# Altium schematic sheet Microcontroller.SchDoc: Microcontroller
size A2; Author: Andy Nicholson; Engineer: Andy Nicholson; Organization: WSU; Address1: Werrington; DocumentNumber: 1; Revision: 2; SheetNumber: 1; SheetTotal: 3
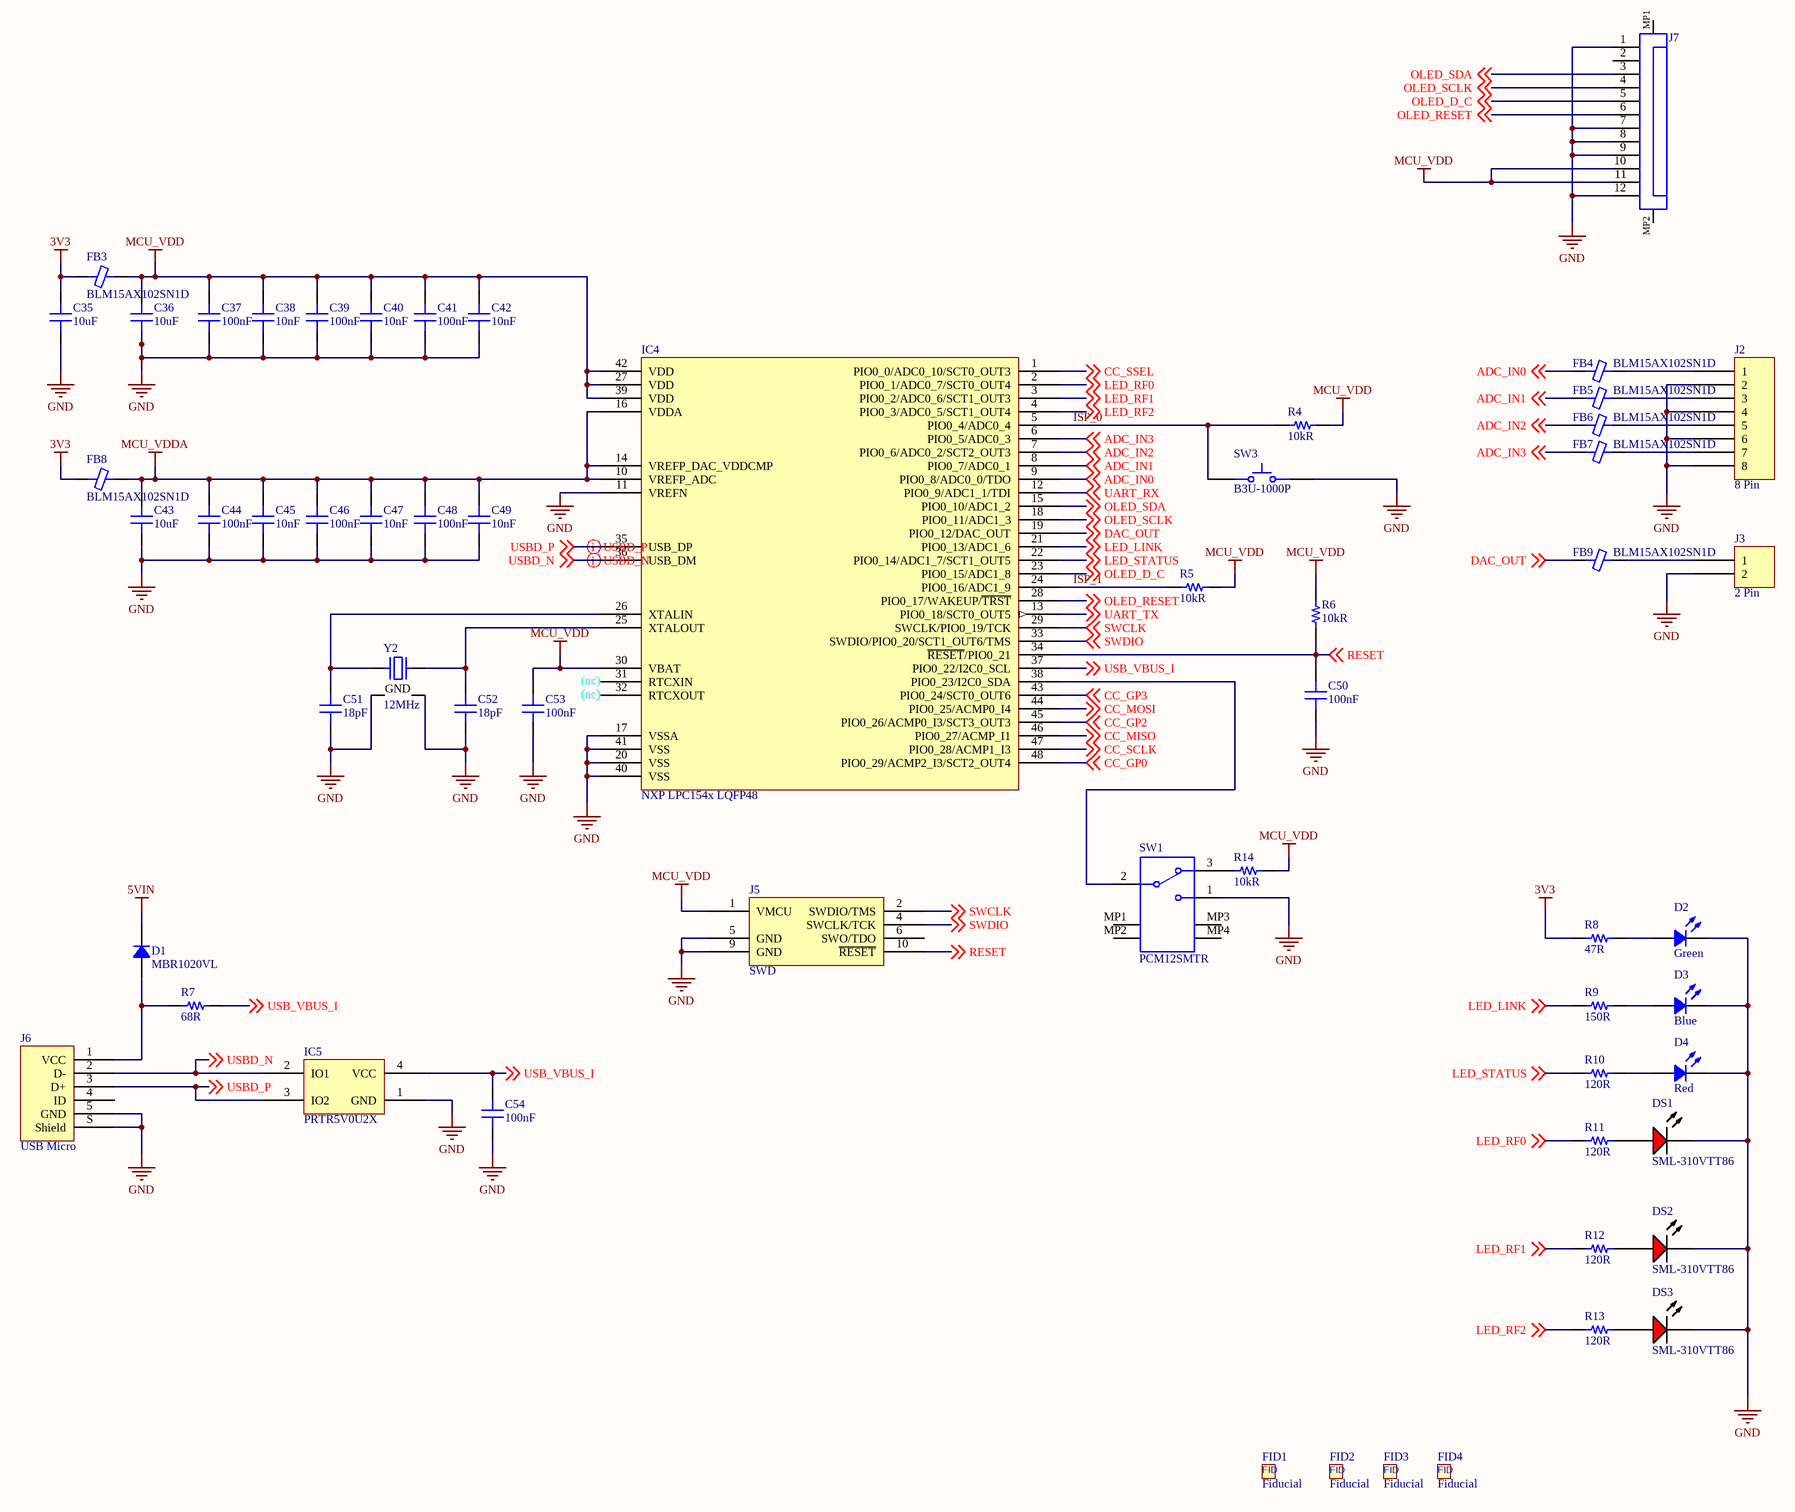
[diagram p0: Microcontroller.SchDoc]

## Parts
C35  10uF  [CAP 0805/2012]
C36  10uF  [CAP 0805/2012]
C37  100nF  [CAP 0402/1005]
C38  10nF  [CAP 0402/1005]
C39  100nF  [CAP 0402/1005]
C40  10nF  [CAP 0402/1005]
C41  100nF  [CAP 0402/1005]
C42  10nF  [CAP 0402/1005]
C43  10uF  [CAP 0805/2012]
C44  100nF  [CAP 0402/1005]
C45  10nF  [CAP 0402/1005]
C46  100nF  [CAP 0402/1005]
C47  10nF  [CAP 0402/1005]
C48  100nF  [CAP 0402/1005]
C49  10nF  [CAP 0402/1005]
C50  100nF  [CAP 0402/1005]
C51  18pF  [CAP 0402/1005]
C52  18pF  [CAP 0402/1005]
C53  100nF  [CAP 0402/1005]
C54  100nF  [CAP 0402/1005]
D1  MBR1020VL  [SOD123F]
D2  Green  [LED 0603/1608 GREEN]
D3  Blue  [LED 0603/1608 BLUE]
D4  Red  [LED 0603/1608 RED]
DS1  SML-310VTT86  [ROHM-SML-31X_V]
DS2  SML-310VTT86  [ROHM-SML-31X_V]
DS3  SML-310VTT86  [ROHM-SML-31X_V]
FB3  BLM15AX102SN1D  [FER 0402/1005]
FB4  BLM15AX102SN1D  [FER 0402/1005]
FB5  BLM15AX102SN1D  [FER 0402/1005]
FB6  BLM15AX102SN1D  [FER 0402/1005]
FB7  BLM15AX102SN1D  [FER 0402/1005]
FB8  BLM15AX102SN1D  [FER 0402/1005]
FB9  BLM15AX102SN1D  [FER 0402/1005]
FID1  Fiducial  [Fiducial]  (no BOM)
FID2  Fiducial  [Fiducial]  (no BOM)
FID3  Fiducial  [Fiducial]  (no BOM)
FID4  Fiducial  [Fiducial]  (no BOM)
IC4  NXP LPC154x LQFP48  [NXP LQFP-48 7x7mm]
IC5  PRTR5V0U2X  [SOT143B]
J2  8 Pin  [FCI 06-381-8PIN]
J3  2 Pin  [FCI 06-381-2PIN]
J5  SWD  [10 Pin SWD]  (no BOM)
J6  USB Micro  [FCI USB 10118193-0001LF]
J7  687112183722  [687112183722]  (value not drawn)
R4  10kR  [RES 0402/1005]
R5  10kR  [RES 0402/1005]
R6  10kR  [RES 0402/1005]
R7  68R  [RES 0402/1005]
R8  47R  [RES 0402/1005]
R9  150R  [RES 0402/1005]
R10  120R  [RES 0402/1005]
R11  120R  [RES 0402/1005]
R12  120R  [RES 0402/1005]
R13  120R  [RES 0402/1005]
R14  10kR  [RES 0402/1005]
SW1  PCM12SMTR  [CKCP-PCM12SMTR_V]
SW3  B3U-1000P  [OMRON-B3U-1000_V]
Y2  12MHz  [ABRACON ABM8G]

## Nets
3V3: C35.2 FB3.2 FB8.2 R8.1
5VIN: D1.2
GND: C35.1 C36.1 C37.1 C38.1 C39.1 C40.1 C41.1 C42.1 C43.1 C44.1 C45.1 C46.1 C47.1 C48.1 C49.1 C50.1 C51.1 C52.1 C53.1 C54.1 D2.2 D3.2 D4.2 DS1.2(K) DS2.2(K) DS3.2(K) IC4.11(VREFN) IC4.17(VSSA) IC4.20(VSS) IC4.40(VSS) IC4.41(VSS) IC5.1(GND) J2.2 J2.4 J2.6 J2.8 J3.2 J5.5(GND) J5.9(GND) J6.5(GND) J6.S(Shield) J7.1 J7.7 J7.8 J7.9 J7.12 SW1.1 SW3.2 Y2.2(GND) Y2.4(GND)
MCU_VDD: C36.2 C37.2 C38.2 C39.2 C40.2 C41.2 C42.2 C53.2 FB3.1 IC4.27(VDD) IC4.30(VBAT) IC4.39(VDD) IC4.42(VDD) J5.1(VMCU) J7.10 J7.11 R4.1 R5.1 R6.1 R14.1
MCU_VDDA: C43.2 C44.2 C45.2 C46.2 C47.2 C48.2 C49.2 FB8.1 IC4.10(VREFP_ADC) IC4.14(VREFP_DAC_VDDCMP) IC4.16(VDDA)
ADC_IN0: FB4.2 IC4.9(PIO0_8/ADC0_0/TDO) ; off-sheet ADC_IN0
ADC_IN1: FB5.2 IC4.8(PIO0_7/ADC0_1) ; off-sheet ADC_IN1
ADC_IN2: FB6.2 IC4.7(PIO0_6/ADC0_2/SCT2_OUT3) ; off-sheet ADC_IN2
ADC_IN3: FB7.2 IC4.6(PIO0_5/ADC0_3) ; off-sheet ADC_IN3
CC_GP0: IC4.48(PIO0_29/ACMP2_I3/SCT2_OUT4) ; off-sheet CC_GP0
CC_GP2: IC4.45(PIO0_26/ACMP0_I3/SCT3_OUT3) ; off-sheet CC_GP2
CC_GP3: IC4.43(PIO0_24/SCT0_OUT6) ; off-sheet CC_GP3
CC_MISO: IC4.46(PIO0_27/ACMP_I1) ; off-sheet CC_MISO
CC_MOSI: IC4.44(PIO0_25/ACMP0_I4) ; off-sheet CC_MOSI
CC_SCLK: IC4.47(PIO0_28/ACMP1_I3) ; off-sheet CC_SCLK
CC_SSEL: IC4.1(PIO0_0/ADC0_10/SCT0_OUT3) ; off-sheet CC_SSEL
DAC_OUT: FB9.2 IC4.19(PIO0_12/DAC_OUT) ; off-sheet DAC_OUT
ISP_0: IC4.5(PIO0_4/ADC0_4) R4.2 SW3.1
ISP_1: IC4.24(PIO0_16/ADC1_9) R5.2
LED_LINK: IC4.21(PIO0_13/ADC1_6) R9.1 ; off-sheet LED_LINK
LED_RF0: IC4.2(PIO0_1/ADC0_7/SCT0_OUT4) R11.1 ; off-sheet LED_RF0
LED_RF1: IC4.3(PIO0_2/ADC0_6/SCT1_OUT3) R12.1 ; off-sheet LED_RF1
LED_RF2: IC4.4(PIO0_3/ADC0_5/SCT1_OUT4) R13.1 ; off-sheet LED_RF2
LED_STATUS: IC4.22(PIO0_14/ADC1_7/SCT1_OUT5) R10.1 ; off-sheet LED_STATUS
OLED_D_C: IC4.23(PIO0_15/ADC1_8) J7.5 ; off-sheet OLED_D_C
OLED_RESET: IC4.28(PIO0_17/WAKEUP/~{TRST}) J7.6 ; off-sheet OLED_RESET
OLED_SCLK: IC4.18(PIO0_11/ADC1_3) J7.4 ; off-sheet OLED_SCLK
OLED_SDA: IC4.15(PIO0_10/ADC1_2) J7.3 ; off-sheet OLED_SDA
RESET: C50.2 IC4.34(~{RESET}/PIO0_21) J5.10(~{RESET}) R6.2 ; off-sheet RESET
SWCLK: IC4.29(SWCLK/PIO0_19/TCK) J5.2(SWDIO/TMS) ; off-sheet SWCLK
SWDIO: IC4.33(SWDIO/PIO0_20/SCT1_OUT6/TMS) J5.4(SWCLK/TCK) ; off-sheet SWDIO
UART_RX: IC4.12(PIO0_9/ADC1_1/TDI) ; off-sheet UART_RX
UART_TX: IC4.13(PIO0_18/SCT0_OUT5) ; off-sheet UART_TX
USB_VBUS_I: C54.2 IC4.37(PIO0_22/I2C0_SCL) IC5.4(VCC) R7.1 ; off-sheet USB_VBUS_I
USBD_N: IC4.36(USB_DM) IC5.2(IO1) J6.2(D-) ; off-sheet USBD_N
USBD_P: IC4.35(USB_DP) IC5.3(IO2) J6.3(D+) ; off-sheet USBD_P
NetC51_2: C51.2 IC4.26(XTALIN) Y2.1
NetC52_2: C52.2 IC4.25(XTALOUT) Y2.3
NetD1_1: D1.1 J6.1(VCC) R7.2
NetD2_1: D2.1 R8.2
NetD3_1: D3.1 R9.2
NetD4_1: D4.1 R10.2
NetDS1_1: DS1.1(A) R11.2
NetDS2_1: DS2.1(A) R12.2
NetDS3_1: DS3.1(A) R13.2
NetFB4_1: FB4.1 J2.1
NetFB5_1: FB5.1 J2.3
NetFB6_1: FB6.1 J2.5
NetFB7_1: FB7.1 J2.7
NetFB9_1: FB9.1 J3.1
NetIC4_38: IC4.38(PIO0_23/I2C0_SDA) SW1.2
NetR14_2: R14.2 SW1.3

Not connected (* = marked no-connect by the designer): IC4 31(RTCXIN) 32(RTCXOUT); J5 6(SWO/TDO); J6 4(ID); J7 2 MP1 MP2; SW1 MP1 MP2 MP3 MP4

## Layout directives
differential pair: USBD_N, USBD_P

## Notes on the sheet
- (nc)
- Title
- Size:
- Date:
- File:
- A2
- Number:
- Time:
- Revision:
- Sheet
- of
- (in symbol Fiducial) FID

## Library data of the parts
C35 C36 C43 = Capacitor: Cap Ceramic 10uF 10V X5R 10% SMD 0805 85C Embossed T/R; Manufacturer 1: Samsung; Manufacturer Part Number 1: CL21A106KPFNNNG; Supplier 1: Digi-Key; Supplier Part Number 1: 1276-6456-1-ND; RoHS: Yes; Category: Ceramic Capacitors; Stock 1: 443468; Pricing 1: 1=0.13000, 10=0.09100, 100=0.04300, 500=0.03016, 1000=0.02497 (USD); Mount: Surface Mount; Case/Package: 0805; Case Code (Metric): 2012; Case Code (Imperial): 0805; Min Operating Temperature: -55°C; Max Operating Temperature: 85°C; Capacitance: 10uF; Tolerance: 10%; Dielectric: X5R; Voltage: 10V; Voltage Rating: 10V; Packaging: Tape and Reel; Package Quantity: 3000; Termination: Wraparound; Length: 2mm; Height: 1.25mm; Depth: 1.25mm; Width: 0.049inch; Thickness: 0.053inch; Radiation Hardening: No; Lead Free: Lead Free; ComponentLink1URL: https://datasheet.ciiva.com/16428/cl21a106kpfnnng-16428896.pdf?src-supplier=Future+Electronics; ComponentLink1Description: https://datasheet.ciiva.com/16428/cl21a106kpfnnng-16428896.pdf?src-supplier=Future+Electronics; ComponentLink2URL: https://datasheet.ciiva.com/26936/getdatasheetpartid-640497-26936900.pdf?src-supplier=Verical; ComponentLink2Description: https://datasheet.ciiva.com/26936/getdatasheetpartid-640497-26936900.pdf?src-supplier=Verical
C37 C39 C41 C44 C46 C48 C50 C53 C54 = Capacitor: Cap Ceramic 0.1uF 10V X5R 20% Pad SMD 0402 85C T/R; Manufacturer 1: Samsung; Manufacturer Part Number 1: CL05A104MP5NNNC; Supplier 1: Digi-Key; Supplier Part Number 1: 1276-1443-1-ND; RoHS: Yes; Category: Ceramic Capacitors; Stock 1: 4686080; Pricing 1: 1=0.10000, 10=0.01900, 100=0.00830, 500=0.00592, 1000=0.00465, 2500=0.00422, 5000=0.00389 (USD); Mount: Surface Mount; Case/Package: 0402; Case Code (Metric): 1005; Case Code (Imperial): 0402; Min Operating Temperature: -55°C; Max Operating Temperature: 85°C; Packaging: Tape and Reel; Capacitance: 100nF; Tolerance: 20%; Voltage Rating: 10V; Dielectric: X5R; Voltage Rating (DC): 10V; Length: 1mm; Height: 0.5mm; Width: 0.02inch; Thickness: 0.022inch; Depth: 0.5mm; Radiation Hardening: No; Lead Free: Lead Free; ComponentLink1URL: https://datasheet.ciiva.com/25709/cl05a104mp5nnnc-25709105.pdf?src-supplier=Digi-Key; ComponentLink1Description: https://datasheet.ciiva.com/25709/cl05a104mp5nnnc-25709105.pdf?src-supplier=Digi-Key
C38 C40 C42 C45 C47 C49 = Capacitor: TAIYO YUDEN - TMK105B7103KV-F - CERAMIC CAPACITOR 0.01UF, 25V, X7R, 10%, 0402, FULL REEL; Supplier 1: Digi-Key; Supplier Part Number 1: 587-1223-1-ND; Manufacturer 1: Taiyo Yuden; Manufacturer Part Number 1: TMK105B7103KV-F; RoHS: Yes; Category: Ceramic Capacitors; Stock 1: 1448575; Pricing 1: 1=0.10000, 10=0.01700, 100=0.00780, 500=0.00554, 1000=0.00436, 2500=0.00396, 5000=0.00364 (USD); Mount: Surface Mount; Case/Package: 0402; Case Code (Metric): 1005; Case Code (Imperial): 0402; Contact Plating: Tin; Min Operating Temperature: -55°C; Max Operating Temperature: 125°C; Capacitance: 10nF; Tolerance: 10%; Package Quantity: 1; Voltage Rating: 25V; Packaging: Tape and Reel; Voltage Rating (DC): 25V; Dielectric: X7R; Termination: SMD/SMT; Composition: Ceramic; Voltage: 25V; Length: 1mm; Height: 0.5mm; Width: 0.02inch; Thickness: 0.022inch; Depth: 0.5mm; REACH SVHC: Unknown; Halogen Free: Halogen Free; ComponentLink1URL: https://datasheet.ciiva.com/129/tmk105b7103kv-f-ss-129699.pdf?src-supplier=Digi-Key; ComponentLink1Description: https://datasheet.ciiva.com/129/tmk105b7103kv-f-ss-129699.pdf?src-supplier=Digi-Key; ComponentLink2URL: https://datasheet.ciiva.com/30192/438tmk105b7103kv-f-30192315.pdf?src-supplier=Onlinecomponents.com; ComponentLink2Description: https://datasheet.ciiva.com/30192/438tmk105b7103kv-f-30192315.pdf?src-supplier=Onlinecomponents.com; ComponentLink3URL: https://datasheet.ciiva.com/15922/204tmk105b7103kv-f-15922348.pdf?src-supplier=Onlinecomponents.com; ComponentLink3Description: https://datasheet.ciiva.com/15922/204tmk105b7103kv-f-15922348.pdf?src-supplier=Onlinecomponents.com; ComponentLink4URL: https://datasheet.ciiva.com/30156/190tmk105b7103kv-f-30156174.pdf?src-supplier=Onlinecomponents.com; ComponentLink4Description: https://datasheet.ciiva.com/30156/190tmk105b7103kv-f-30156174.pdf?src-supplier=Onlinecomponents.com; ComponentLink5URL: https://datasheet.ciiva.com/7975/746258-7975835.pdf?src-supplier=Element14; ComponentLink5Description: https://datasheet.ciiva.com/7975/746258-7975835.pdf?src-supplier=Element14; ComponentLink6URL: https://datasheet.ciiva.com/28645/746258-28645254.pdf?src-supplier=Element14; ComponentLink6Description: https://datasheet.ciiva.com/28645/746258-28645254.pdf?src-supplier=Element14
C51 C52 = Capacitor: CAP CER 18PF 50V C0G/NPO 0402; Manufacturer 1: Yageo; Manufacturer Part Number 1: CC0402JRNPO9BN180; Tolerance: 5%; Dielectric: C0G; Temperature Coefficient: 30ppm/°C; Supplier 1: Digi-Key; Supplier Part Number 1: 311-1415-1-ND; RoHS: Yes; Category: Ceramic Capacitors; Stock 1: 739848; Pricing 1: 1=0.10000, 10=0.02300, 100=0.01030, 500=0.00736, 1000=0.00578, 2500=0.00525, 5000=0.00483 (USD); Mount: Surface Mount; Case/Package: 0402; Number of Pins: 2; Weight: 2.3E-05oz; Case Code (Metric): 1005; Case Code (Imperial): 0402; Min Operating Temperature: -55°C; Max Operating Temperature: 125°C; Capacitance: 18pF; Voltage Rating: 50V; Packaging: Tape and Reel; Package Quantity: 1; Voltage Rating (DC): 50V; Termination: SMD/SMT; Composition: Ceramic; Voltage: 50V; Length: 1mm; Height: 0.5mm; Width: 0.02inch; Thickness: 0.022inch; Depth: 0.5mm; Radiation Hardening: No; REACH SVHC: No SVHC; Lead Free: Lead Free; ComponentLink1URL: https://datasheet.ciiva.com/11788/0900766b80d84fbf-11788369.pdf?src-supplier=RSComponents; ComponentLink1Description: https://datasheet.ciiva.com/11788/0900766b80d84fbf-11788369.pdf?src-supplier=RSComponents; ComponentLink2URL: https://datasheet.ciiva.com/176/mlccorderingcode-176357.pdf?src-supplier=Digi-Key; ComponentLink2Description: https://datasheet.ciiva.com/176/mlccorderingcode-176357.pdf?src-supplier=Digi-Key; ComponentLink3URL: https://datasheet.ciiva.com/176/mlccorderingcode-176358.pdf?src-supplier=Digi-Key; ComponentLink3Description: https://datasheet.ciiva.com/176/mlccorderingcode-176358.pdf?src-supplier=Digi-Key; ComponentLink4URL: https://datasheet.ciiva.com/176/mlccorderingcode-176359.pdf?src-supplier=Digi-Key; ComponentLink4Description: https://datasheet.ciiva.com/176/mlccorderingcode-176359.pdf?src-supplier=Digi-Key; ComponentLink5URL: https://datasheet.ciiva.com/28450/1443161-28450232.pdf?src-supplier=Element14; ComponentLink5Description: https://datasheet.ciiva.com/28450/1443161-28450232.pdf?src-supplier=Element14; ComponentLink6URL: https://datasheet.ciiva.com/13208/upy-gp-np0-16v-to-50v-8-13208430.pdf?src-supplier=Mouser; ComponentLink6Description: https://datasheet.ciiva.com/13208/upy-gp-np0-16v-to-50v-8-13208430.pdf?src-supplier=Mouser; ComponentLink7URL: https://datasheet.ciiva.com/11587/upy-gp-np0-16v-to-50v-8-11587087.pdf?src-supplier=Avnet; ComponentLink7Description: https://datasheet.ciiva.com/11587/upy-gp-np0-16v-to-50v-8-11587087.pdf?src-supplier=Avnet
D1 = Diode: DIODE SCHOTTKY 20V 1A SOD123F; Manufacturer 1: ON Semiconductor / Fairchild; Reverse Recovery Time: 12.4ns; Element Configuration: Single; Max Forward Surge Current (Ifsm): 45A; Supplier 1: Digi-Key; Supplier Part Number 1: MBR1020VLCT-ND; Manufacturer Part Number 1: MBR1020VL; RoHS: Yes; Category: Rectifier Diodes; Stock 1: 14914; Pricing 1: 1=0.41000, 10=0.30300, 100=0.17170, 500=0.11370, 1000=0.08717 (USD); Mount: Surface Mount; Weight: 0.0276g; Packaging: Tape and Reel; Average Rectified Current: 1A; Max Repetitive Reverse Voltage (Vrrm): 20V; Max Reverse Voltage (DC): 20V; ComponentLink1URL: http://www.farnell.com/datasheets/2552643.pdf?src-supplier=Farnell; ComponentLink1Description: http://www.farnell.com/datasheets/2552643.pdf?src-supplier=Farnell; ComponentLink2URL: https://www.fairchildsemi.com/datasheets/MB/MBR1020VL.pdf?src-supplier=Digi-Key; ComponentLink2Description: https://www.fairchildsemi.com/datasheets/MB/MBR1020VL.pdf?src-supplier=Digi-Key; ComponentLink3URL: http://www.farnell.com/datasheets/2552643.pdf?src-supplier=Newark; ComponentLink3Description: http://www.farnell.com/datasheets/2552643.pdf?src-supplier=Newark
D2 = LED: 0603 green led allngap 571nm-574nm water clear 18-71mcd 130d; Manufacturer 1: Vishay Lite-On; Manufacturer Part Number 1: LTST-C190KGKT; Lens Color: Colorless; Lens Style: Diffused,Colorless,Rectangular,Clear; Forward Voltage: 2V; Luminous Intensity: 35mcd; Viewing Angle: 130°; Dominant Wavelength: 571nm; Test Current: 20mA; Wavelength: 574nm; Forward Current: 30mA; Power Rating: 75mW; Number of Elements: 1; Reverse Voltage: 5V; Supplier 1: Digi-Key; Supplier Part Number 1: 160-1435-1-ND; RoHS: Yes; Category: LEDs; Stock 1: 642633; Pricing 1: 1=0.26000, 10=0.18800, 100=0.08880, 500=0.05922, 1000=0.04639 (USD); Mount: Surface Mount; Case/Package: 0603; Number of Pins: 2; Color: Green; Case Code (Metric): 1608; Case Code (Imperial): 0603; Min Operating Temperature: -55°C; Max Operating Temperature: 85°C; Packaging: Tape and Reel; Package Quantity: 1; Lens Transparency: Clear; Illumination Color: Green; Power Dissipation: 75mW; Number of LEDs: 1; Length: 1.6mm; Height: 0.8mm; Width: 0.8mm; Depth: 0.8mm; Radiation Hardening: No; Lead Free: Lead Free; ComponentLink1URL: https://datasheet.ciiva.com/15117/getdatasheetpartid-141494-15117731.pdf?src-supplier=Verical; ComponentLink1Description: https://datasheet.ciiva.com/15117/getdatasheetpartid-141494-15117731.pdf?src-supplier=Verical; ComponentLink2URL: https://datasheet.ciiva.com/12403/100-ltst-c190kgkt-63268-12403899.pdf?src-supplier=Mouser; ComponentLink2Description: https://datasheet.ciiva.com/12403/100-ltst-c190kgkt-63268-12403899.pdf?src-supplier=Mouser; ComponentLink3URL: https://datasheet.ciiva.com/11774/0900766b80dc02a8-11774060.pdf?src-supplier=RSComponents; ComponentLink3Description: https://datasheet.ciiva.com/11774/0900766b80dc02a8-11774060.pdf?src-supplier=RSComponents; ComponentLink4URL: https://datasheet.ciiva.com/2109/s-110-ltst-c190kgkt-2109988.pdf?src-supplier=Digi-Key; ComponentLink4Description: https://datasheet.ciiva.com/2109/s-110-ltst-c190kgkt-2109988.pdf?src-supplier=Digi-Key; ComponentLink5URL: https://datasheet.ciiva.com/2109/s-110-ltst-c190kgkt-2109989.pdf?src-supplier=Digi-Key; ComponentLink5Description: https://datasheet.ciiva.com/2109/s-110-ltst-c190kgkt-2109989.pdf?src-supplier=Digi-Key; ComponentLink6URL: https://datasheet.ciiva.com/2109/s-110-ltst-c190kgkt-2109990.pdf?src-supplier=Digi-Key; ComponentLink6Description: https://datasheet.ciiva.com/2109/s-110-ltst-c190kgkt-2109990.pdf?src-supplier=Digi-Key
D3 = LED: LED Uni-Color Blue 468nm 2-Pin Chip 0603(1608Metric) T/R; Manufacturer 1: Everlight; Manufacturer Part Number 1: 19-213SUBC/S400-A5/S208-2/TR8; Supplier 1: Digi-Key; Supplier Part Number 1: 1080-1581-1-ND; Stock 1: 47392; Pricing 1: 1=0.34000, 10=0.24900, 100=0.11810, 500=0.07876, 1000=0.06169, 2500=0.06038, 5000=0.05250 (USD); ComponentLink1URL: https://media.digikey.com/pdf/Data%20Sheets/Everlight%20PDFs/19-213SUBC-S400-A5-S208-2-TR8.pdf?src-supplier=Digi-Key; ComponentLink1Description: https://media.digikey.com/pdf/Data%20Sheets/Everlight%20PDFs/19-213SUBC-S400-A5-S208-2-TR8.pdf?src-supplier=Digi-Key
D4 = LED: LED RED DIFFUSED 1608 SMD; Manufacturer 1: Rohm; Manufacturer Part Number 1: SML-D12U1WT86; Lens Color: White; Luminous Intensity: 63mcd; Test Current: 20mA; Dominant Wavelength: 620nm; Forward Voltage: 2.2V; Supplier 1: Digi-Key; Supplier Part Number 1: SML-D12U1WT86CT-ND; RoHS: Yes; Category: LEDs; Stock 1: 96413; Pricing 1: 1=0.21000, 10=0.15500, 100=0.07330, 500=0.04884, 1000=0.03826 (USD); Mount: Surface Mount; Case/Package: 0603; Color: Red; Case Code (Metric): 1608; Case Code (Imperial): 0603; Packaging: Tape and Reel; Lens Transparency: Diffused; Length: 1.6mm; Height: 0.65mm; Width: 0.8mm; Lead Free: Lead Free; ComponentLink1URL: https://www.rohm.com/datasheet/SML-D12U1W?src-supplier=Digi-Key; ComponentLink1Description: https://www.rohm.com/datasheet/SML-D12U1W?src-supplier=Digi-Key
DS1-DS3 = CMP-2000-07115-1: Standard Type Mini-Molded Chip LED, Red, 2 V, 20 mA, -30 to 85 degC, 2-Pin SMD, RoHS, Tape and Reel; Manufacturer: Rohm; Intensity: 4mcd; Lens Type: Clear; Forward (Drive) Current: 20mA; Viewing Angle: 140°; Forward Voltage: 2V; Manufacturer URL: http://www.rohm.com/web/global/; Datasheet URL: http://media.digikey.com/pdf/Data%20Sheets/Rohm%20PDFs/SML-310%20Series.pdf; Package Description: 2-Pin Surface Mount Device, Body 1.6 x 0.8 mm; Color: Red; Dimension: 1.6x0.8x0.8mm; Datasheet Version: Rev. 1.1, 07/2004; Package Reference: SML-31X; Mounting Technology: SurfaceMount
FB3-FB9 = Ferrite Chip: Ferrite Beads Multi-Layer 1KOhm 25% 100MHz 350mA 490mOhm DCR 0402 T/R; Manufacturer 1: Murata; Material: Ferrite,Steel; Impedance: 1kR; Number of Lines: 1; DC Resistance (DCR): 490mR; Supplier 1: Digi-Key; Supplier Part Number 1: 490-5442-1-ND; Manufacturer Part Number 1: BLM15AX102SN1D; RoHS: Yes; Category: Ferrite Beads and Chips; Stock 1: 214606; Pricing 1: 1=0.11000, 10=0.09000, 25=0.08120, 50=0.05960, 100=0.05140, 250=0.04060, 500=0.03428, 1000=0.02886, 5000=0.02571 (USD); Case/Package: 0402; Number of Pins: 2; Case Code (Metric): 1005; Case Code (Imperial): 0402; Min Operating Temperature: -55°C; Max Operating Temperature: 125°C; Package Quantity: 1; Tolerance: 25%; Packaging: Tape and Reel; Current Rating: 350mA; Max Current Rating: 350mA; Termination: SMD/SMT; Max DC Current: 350mA; Test Frequency: 100MHz; Number of Circuits: 1; Length: 1mm; Height: 0.5mm; Width: 0.5mm; Depth: 0.5mm; REACH SVHC: No SVHC; Lead Free: Lead Free; ComponentLink1URL: https://datasheet.ciiva.com/41425/001171674-da-01-en-chip-drossel0402-1000r-350ma-1-0x0-5mm-41425706.pdf?src-supplier=Conrad; ComponentLink1Description: https://datasheet.ciiva.com/41425/001171674-da-01-en-chip-drossel0402-1000r-350ma-1-0x0-5mm-41425706.pdf?src-supplier=Conrad; ComponentLink2URL: https://datasheet.ciiva.com/41449/001172166-da-01-en-drossel-0402-1000r-31-0x0-5mm-10000st-41449452.pdf?src-supplier=Conrad; ComponentLink2Description: https://datasheet.ciiva.com/41449/001172166-da-01-en-drossel-0402-1000r-31-0x0-5mm-10000st-41449452.pdf?src-supplier=Conrad; ComponentLink3URL: https://datasheet.ciiva.com/1012/l0110e-1012389.pdf?src-supplier=Digi-Key; ComponentLink3Description: https://datasheet.ciiva.com/1012/l0110e-1012389.pdf?src-supplier=Digi-Key; ComponentLink4URL: https://datasheet.ciiva.com/1012/l0110e-1012390.pdf?src-supplier=Digi-Key; ComponentLink4Description: https://datasheet.ciiva.com/1012/l0110e-1012390.pdf?src-supplier=Digi-Key; ComponentLink5URL: https://datasheet.ciiva.com/1012/l0110e-1012391.pdf?src-supplier=Digi-Key; ComponentLink5Description: https://datasheet.ciiva.com/1012/l0110e-1012391.pdf?src-supplier=Digi-Key; ComponentLink6URL: https://datasheet.ciiva.com/16420/l0110s0100blm15ax-sn-16420798.pdf?src-supplier=Future+Electronics; ComponentLink6Description: https://datasheet.ciiva.com/16420/l0110s0100blm15ax-sn-16420798.pdf?src-supplier=Future+Electronics
IC4 = NXP LPC154x LQFP48: IC MCU 32BIT 256KB FLASH 48LQFP; Manufacturer 1: NXP Semiconductors; Manufacturer Part Number 1: LPC1549JBD48QL; Core Architecture: ARM; Interface: I2C,SPI,USB,CAN,UART,USART; Min Supply Voltage: 2.4V; Max Supply Voltage: 3.6V; Operating Supply Voltage: 3.3V; RAM Size: 36KB; Number of I/Os: 30; Frequency: 72MHz; Data Bus Width: 32b; Max Power Dissipation: 1.5W; Number of Timers/Counters: 4; Watchdog Timer: Yes; Oscillator Type: Internal; Number of ADC Channels: 16; Peripherals: Brown-out Detect/Reset,POR,PWM,WDT,DMA; Supplier 1: Digi-Key; Supplier Part Number 1: 568-11349-ND; RoHS: Yes; Category: Microcontrollers; Stock 1: 822; Pricing 1: 1=7.29000, 10=6.58500, 25=6.27920, 100=5.45210, 500=4.74766, 1000=4.13505 (USD); Case/Package: LQFP; Number of Pins: 48; Weight: 6.287584oz; Min Operating Temperature: -40°C; Max Operating Temperature: 105°C; Package Quantity: 250; Packaging: Tray; Memory Size: 256KB; Memory Type: FLASH; Number of Programmable I/O: 30; Max Frequency: 72MHz; Radiation Hardening: No; REACH SVHC: No SVHC; Lead Free: Lead Free; ComponentLink1URL: https://datasheet.ciiva.com/29718/lpc15xx-29718838.pdf?src-supplier=Digi-Key; ComponentLink1Description: https://datasheet.ciiva.com/29718/lpc15xx-29718838.pdf?src-supplier=Digi-Key; ComponentLink2URL: https://datasheet.ciiva.com/46427/1802143-46427720.pdf?src-supplier=Element14; ComponentLink2Description: https://datasheet.ciiva.com/46427/1802143-46427720.pdf?src-supplier=Element14
IC5 = NXP PRTR5V0U2X: TVS DIODE 5.5V SOT143B; Manufacturer 1: Nexperia USA; Manufacturer Part Number 1: PRTR5V0U2X,215; Supplier 1: Digi-Key; Supplier Part Number 1: 1727-3884-1-ND; RoHS: No; Stock 1: 224080; Pricing 1: 1=0.52000, 10=0.44700, 100=0.33400, 500=0.26240, 1000=0.20276 (USD); ComponentLink1URL: https://assets.nexperia.com/documents/data-sheet/PRTR5V0U2X.pdf?src-supplier=Digi-Key; ComponentLink1Description: https://assets.nexperia.com/documents/data-sheet/PRTR5V0U2X.pdf?src-supplier=Digi-Key
J2 = 8 Pin: TERM BLOCK HDR 8POS 90DEG 3.81MM; Manufacturer 1: Amphenol Anytek; Manufacturer Part Number 1: OQ0832510000G; Supplier 1: Digi-Key; Supplier Part Number 1: 609-3825-ND; RoHS: No; Stock 1: 4787; Pricing 1: 1=1.06000, 10=0.66200, 25=0.56640, 50=0.50920, 100=0.49860, 250=0.42432, 500=0.40310, 1000=0.36067, 5000=0.28217 (USD); ComponentLink1URL: http://www.anytek.com.tw/UserUpFiles/20120526/jMKyryrC5T7A.pdf?src-supplier=Digi-Key; ComponentLink1Description: http://www.anytek.com.tw/UserUpFiles/20120526/jMKyryrC5T7A.pdf?src-supplier=Digi-Key
J3 = 2 Pin: TERM BLOCK HDR 2POS 90DEG 3.81MM; Manufacturer 1: Amphenol; Manufacturer Part Number 1: OQ0232510000G; Supplier 1: Digi-Key; Supplier Part Number 1: 609-3819-ND; RoHS: No; Stock 1: 14534; Pricing 1: 1=0.49000, 10=0.25600, 25=0.18120, 50=0.15420, 100=0.14870, 250=0.12572, 500=0.11628, 1000=0.10275, 5000=0.07842 (USD); ComponentLink1URL: http://www.anytek.com.tw/UserUpFiles/20120526/jMKyryrC5T7A.pdf?src-supplier=Digi-Key; ComponentLink1Description: http://www.anytek.com.tw/UserUpFiles/20120526/jMKyryrC5T7A.pdf?src-supplier=Digi-Key
J6 = USB 2.0 Type B Micro: CONN RCPT USB2.0 MICRO B SMD R/A; Manufacturer 1: Amphenol FCI; Manufacturer Part Number 1: 10118193-0001LF; Gender: Female; Connector Type: USB,Receptacle; Number of Contacts: 5; Insulation Resistance: 1GR; Number of Ports: 1; Current Rating: 1.8A; Max Voltage Rating (AC): 100V; Pitch: 0.65mm; Supplier 1: Digi-Key; Supplier Part Number 1: 609-4616-1-ND; RoHS: Yes; Category: USB Connectors; Stock 1: 110752; Pricing 1: 1=0.43000, 10=0.40500, 25=0.36440, 50=0.32400, 100=0.31040, 250=0.28344, 500=0.26994 (USD); Mount: Surface Mount,Horizontal; Contact Material: Copper Alloy; Contact Plating: Gold; Color: Black; Number of Terminals: 5; Housing Material: Polymer; Min Operating Temperature: -55°C; Max Operating Temperature: 85°C; Termination: Solder; Orientation: Right Angle; Package Quantity: 1200; Packaging: Tape and Reel; Voltage Rating: 100V; Features: Shielded; Length: 7.86mm; Depth: 5.67mm; Radiation Hardening: No; Flammability Rating: UL94 V-0; ComponentLink1URL: https://datasheet.ciiva.com/851/10118193-851106.pdf?src-supplier=Digi-Key; ComponentLink1Description: https://datasheet.ciiva.com/851/10118193-851106.pdf?src-supplier=Digi-Key; ComponentLink2URL: https://datasheet.ciiva.com/14802/10118193-0001lf-webpage-14802386.pdf?src-supplier=Arrow; ComponentLink2Description: https://datasheet.ciiva.com/14802/10118193-0001lf-webpage-14802386.pdf?src-supplier=Arrow; ComponentLink3URL: https://datasheet.ciiva.com/26853/getdatasheetpartid-418618-26853893.pdf?src-supplier=Verical; ComponentLink3Description: https://datasheet.ciiva.com/26853/getdatasheetpartid-418618-26853893.pdf?src-supplier=Verical; ComponentLink4URL: https://datasheet.ciiva.com/4598/10118193ac-197151-4598799.pdf?src-supplier=Mouser; ComponentLink4Description: https://datasheet.ciiva.com/4598/10118193ac-197151-4598799.pdf?src-supplier=Mouser; ComponentLink5URL: https://datasheet.ciiva.com/851/10118193-851107.pdf?src-supplier=Digi-Key; ComponentLink5Description: https://datasheet.ciiva.com/851/10118193-851107.pdf?src-supplier=Digi-Key; ComponentLink6URL: https://datasheet.ciiva.com/851/10118193-851108.pdf?src-supplier=Digi-Key; ComponentLink6Description: https://datasheet.ciiva.com/851/10118193-851108.pdf?src-supplier=Digi-Key; ComponentLink7URL: https://datasheet.ciiva.com/14618/70236827-14618887.pdf?src-supplier=Allied+Electronics; ComponentLink7Description: https://datasheet.ciiva.com/14618/70236827-14618887.pdf?src-supplier=Allied+Electronics
J7 = CMP-1502-01575-1: SMT ZIF Connectors Low Profile WR-FPC, Horizontal, Bottom Contact, pitch 0.5 mm, 12 pins; Manufacturer: Wurth Elektronik; Rated Current: 0.4A; Pin Number: 12; Pitch: 0.5mm; Contact Resistance: 30mOhm; Withstanding Voltage: 250VAC; Working Voltage: 50VAC; Manufacturer URL: http://www.we-online.de; Packaging: TapeandReel; Mounting Technology: SMT; Part Number: 687112183722; Orientation: Horizontal; Operating Temperature: -25to85degC; Datasheet URL: https://katalog.we-online.de/em/datasheet/687112183722.pdf; Contact Design: BottomContact; Publisher: WurthElektronik; Package Reference: 687112183722
R4-R6 R14 = Resistor: RES 10K OHM 5% 1/16W 0402; Manufacturer 1: Stackpole Electronics; Manufacturer Part Number 1: RMCF0402JT10K0; Power Rating: 62.5mW; Max Power Dissipation: 63mW; Temperature Coefficient: 100ppm/°C; Working Voltage: 50V; Supplier 1: Digi-Key; Supplier Part Number 1: RMCF0402JT10K0CT-ND; RoHS: Yes; Category: Chip SMD Resistors; Stock 1: 966187; Pricing 1: 1=0.10000, 10=0.01200, 100=0.00480, 1000=0.00214, 2500=0.00186, 5000=0.00154 (USD); Mount: Surface Mount; Case/Package: 0402; Case Code (Metric): 1005; Case Code (Imperial): 0402; Contact Plating: Tin,Matte; Min Operating Temperature: -55°C; Max Operating Temperature: 155°C; Packaging: Tape and Reel; Resistance: 10kR; Tolerance: 5%; Composition: Thick Film; Number of Terminations: 2; Military Standard: Not; Features: Automotive AEC-Q200; Length: 1mm; Height: 0.016inch; Width: 0.02inch; Depth: 0.5mm; Radiation Hardening: No; Lead Free: Lead Free; ComponentLink1URL: https://datasheet.ciiva.com/15193/getdatasheetpartid-360689-15193431.pdf?src-supplier=Verical; ComponentLink1Description: https://datasheet.ciiva.com/15193/getdatasheetpartid-360689-15193431.pdf?src-supplier=Verical
R7 = Resistor: RES SMD 68 OHM 5% 1/16W 0402; Manufacturer 1: Stackpole Electronics; Manufacturer Part Number 1: RMCF0402JT68R0; Power Rating: 63mW; Temperature Coefficient: 100ppm/°C; Supplier 1: Digi-Key; Supplier Part Number 1: RMCF0402JT68R0CT-ND; RoHS: Yes; Category: Chip SMD Resistors; Stock 1: 5952; Pricing 1: 1=0.10000, 10=0.01200, 100=0.00480, 1000=0.00214, 2500=0.00186, 5000=0.00154 (USD); Mount: Surface Mount; Case/Package: 0402; Case Code (Metric): 1005; Case Code (Imperial): 0402; Contact Plating: Tin,Matte; Min Operating Temperature: -55°C; Max Operating Temperature: 155°C; Resistance: 68R; Tolerance: 5%; Packaging: Tape and Reel; Composition: Thick Film; Number of Terminations: 2; Max Power Dissipation: 63mW; Features: Automotive AEC-Q200; Length: 0.039inch; Height: 0.016inch; Width: 0.02inch; Radiation Hardening: No; Lead Free: Lead Free; ComponentLink1URL: https://www.seielect.com/Catalog/SEI-RMCF_RMCP.pdf?src-supplier=Digi-Key; ComponentLink1Description: https://www.seielect.com/Catalog/SEI-RMCF_RMCP.pdf?src-supplier=Digi-Key; ComponentLink2URL: https://www.seielect.com/catalog/SEI-Packaging.pdf?src-supplier=Digi-Key; ComponentLink2Description: https://www.seielect.com/catalog/SEI-Packaging.pdf?src-supplier=Digi-Key; ComponentLink3URL: https://www.seielect.com/catalog/SEI-RMCF_RMCP.pdf?src-supplier=Avnet; ComponentLink3Description: https://www.seielect.com/catalog/SEI-RMCF_RMCP.pdf?src-supplier=Avnet; ComponentLink4URL: http://www.seielect.com/Catalog/Sei-RMC.pdf?src-supplier=Future+Electronics; ComponentLink4Description: http://www.seielect.com/Catalog/Sei-RMC.pdf?src-supplier=Future+Electronics
R8 = Resistor: KOA SPEAR ELECTRONICS - RK73B1JTTD470J - RES, 47R, 5%, 0.1W, 0603, THICK FILM; Manufacturer 1: KOA Speer; Power Rating: 100mW; Voltage Rating: 50V; Temperature Coefficient: 200ppm/°C; Supplier 1: Digi-Key; Supplier Part Number 1: 2019-RK73B1JTTD470JCT-ND; Manufacturer Part Number 1: RK73B1JTTD470J; RoHS: Yes; Category: Chip SMD Resistors; Stock 1: 401047; Pricing 1: 1=0.10000, 10=0.01500, 100=0.00610, 1000=0.00275, 2500=0.00239 (USD); Case/Package: 0603; Number of Pins: 2; Case Code (Imperial): 0603; Case Code (Metric): 1608; Min Operating Temperature: -55°C; Max Operating Temperature: 155°C; Packaging: Tape and Reel; Resistance: 47R; Tolerance: 5%; Composition: Thick Film; Termination: SMD/SMT; Military Standard: Not; Voltage Rating (DC): 50V; Length: 1.6mm; Height: 0.45mm; Depth: 0.8mm; REACH SVHC: Unknown; Lead Free: Lead Free; ComponentLink1URL: https://datasheet.ciiva.com/5554/rk73b-5554549.pdf?src-supplier=Mouser; ComponentLink1Description: https://datasheet.ciiva.com/5554/rk73b-5554549.pdf?src-supplier=Mouser; ComponentLink2URL: https://datasheet.ciiva.com/7763/548635-7763063.pdf?src-supplier=Element14; ComponentLink2Description: https://datasheet.ciiva.com/7763/548635-7763063.pdf?src-supplier=Element14
R9 = Resistor: Res Thick Film 0603 150 Ohm 5% 0.1W(1/10W) ±200ppm/C Molded SMD Automotive Punched Paper T/R; Manufacturer 1: KOA Speer; Manufacturer Part Number 1: RK73B1JTTD151J; Power Rating: 100mW; Voltage Rating: 50V; Temperature Coefficient: 200ppm/°C; Supplier 1: Digi-Key; Supplier Part Number 1: 2019-RK73B1JTTD151JCT-ND; RoHS: Yes; Category: Chip SMD Resistors; Stock 1: 242234; Pricing 1: 1=0.10000, 10=0.01500, 100=0.00610, 1000=0.00275, 2500=0.00239 (USD); Case/Package: 0603; Case Code (Imperial): 0603; Case Code (Metric): 1608; Min Operating Temperature: -55°C; Max Operating Temperature: 155°C; Resistance: 150R; Tolerance: 5%; Packaging: Tape and Reel; Package Quantity: 5000; Composition: Thick Film; Termination: SMD/SMT; Military Standard: Not; Voltage Rating (DC): 50V; Length: 1.6mm; Height: 0.45mm; Width: 0.8mm; Depth: 0.8mm; REACH SVHC: Unknown; Lead Free: Lead Free; ComponentLink1URL: https://datasheet.ciiva.com/5554/rk73b-5554597.pdf?src-supplier=Mouser; ComponentLink1Description: https://datasheet.ciiva.com/5554/rk73b-5554597.pdf?src-supplier=Mouser; ComponentLink2URL: https://datasheet.ciiva.com/7984/548635-7984858.pdf?src-supplier=Element14; ComponentLink2Description: https://datasheet.ciiva.com/7984/548635-7984858.pdf?src-supplier=Element14; ComponentLink3URL: https://datasheet.ciiva.com/15159/getdatasheetpartid-30094-15159292.pdf?src-supplier=Verical; ComponentLink3Description: https://datasheet.ciiva.com/15159/getdatasheetpartid-30094-15159292.pdf?src-supplier=Verical
R10-R13 = Resistor: KOA SPEER ELECTRONICS   RK73B1JTTD121J   Surface Mount Chip Resistor, Thick Film, RK73B Series, 120 ohm, 100 mW,  5%, 50 V; Power Rating: 100mW; Voltage Rating: 50V; Temperature Coefficient: 200ppm/°C; Supplier 1: Digi-Key; Supplier Part Number 1: 2019-RK73B1JTTD121JCT-ND; Manufacturer 1: KOA Speer; Manufacturer Part Number 1: RK73B1JTTD121J; RoHS: Yes; Category: Chip SMD Resistors; Stock 1: 13683; Pricing 1: 1=0.10000, 10=0.01500, 100=0.00610, 1000=0.00275, 2500=0.00239 (USD); Case/Package: 0603; Number of Pins: 2; Case Code (Imperial): 0603; Case Code (Metric): 1608; Min Operating Temperature: -55°C; Max Operating Temperature: 155°C; Packaging: Tape and Reel; Resistance: 120R; Tolerance: 5%; Package Quantity: 5000; Composition: Thick Film; Termination: SMD/SMT; Military Standard: Not; Voltage Rating (DC): 50V; Length: 1.6mm; Height: 0.45mm; Width: 0.8mm; Depth: 0.8mm; REACH SVHC: Unknown; Lead Free: Lead Free; ComponentLink1URL: https://datasheet.ciiva.com/15159/getdatasheetpartid-72392-15159751.pdf?src-supplier=Verical; ComponentLink1Description: https://datasheet.ciiva.com/15159/getdatasheetpartid-72392-15159751.pdf?src-supplier=Verical; ComponentLink2URL: https://datasheet.ciiva.com/7773/548635-7773279.pdf?src-supplier=Element14; ComponentLink2Description: https://datasheet.ciiva.com/7773/548635-7773279.pdf?src-supplier=Element14
SW1 = CMP-2000-06884-1: Ultraminiature Slide Switch, SPDT, 0.3 A, 6 V, -20 to 85 degC, 3-Pin SMD, RoHS, Tape and Reel; Manufacturer: C&K Components; Switch Operation: On-On; Contact Current-Max: 0.3A; Datasheet Version: 02/2016; Package Reference: PCM12SMTR; Package Description: 3-Pin Surface Mount Device, Body 6.7 x 2.6 mm; Contact Material: SilverOverCopper; Mounting Technology: SurfaceMount; Circuitry: SPDT; Datasheet URL: http://www.ck-components.com/media/1424/pcm.pdf; Termination Style: RightAngle/SurfaceMount; Manufacturer URL: http://www.ckswitches.com/
SW3 = CMP-2100-03586-1: Ultra-Small Tactile Switch, 0.05 A, 12 V, -25 to 70 degC, 2-Pin SMD, RoHS, Tape and Reel; Manufacturer: Omron Electronic Components; Operating Force: 1.5N; Current Rating: 50mA; Voltage Rating (DC): 12V; Electrical Life: 200000Cycles; Actuator Length: 0.4mm; Insulation Resistance: 100MOhm; Switch Travel: 0.15mm; Throw Configuration: SPST; Illumination Type: Illuminated; Width: 3mm; Weight: 0.022g; Datasheet Version: 42005.0; Datasheet URL: http://www.omron.com/ecb/products/pdf/en-b3u.pdf; Height: 1.2mm; Package Quantity: 1; REACH SVHC: Unknown; Contact Current Rating: 50mA; Contact Material: Silver; Max Current Rating: 50mA; Package Reference: B3U-1000; Termination: SMD/SMT; Packaging: TapeandReel; Manufacturer URL: http://www.omron.com/; RoHSCompliant: true; Mount: SurfaceMount; Length: 4mm; Min Operating Temperature: -25degC; Depth: 2.5mm; Lead Free: LeadFree; Case/Package: SMD/SMT; Package Description: 2-Pin Surface Mount Device, Body 3 x 2.5 mm; Max Operating Temperature: 70degC; Orientation: Straight
Y2 = Abracon Crystal ABM8G: CRYSTAL 12.0000MHZ 18PF SMD; Manufacturer Part Number 1: ABM8G-12.000MHZ-18-D2Y-T3; Frequency Tolerance: 20ppm; ESR (Equivalent Series Resistance): 120R; Frequency Stability: 30ppm; Supplier 1: Digi-Key; Supplier Part Number 1: 535-14128-1-ND; Manufacturer 1: Abracon; RoHS: Yes; Category: Crystals; Stock 1: 1612; Pricing 1: 1=1.00000, 10=0.88600, 50=0.82780, 100=0.73150, 500=0.69300, 1000=0.57750 (USD); Mount: Surface Mount; Case/Package: SMD/SMT; Number of Pins: 4; Min Operating Temperature: -40°C; Max Operating Temperature: 85°C; Frequency: 12MHz; Load Capacitance: 18pF; Packaging: Tape and Reel; Package Quantity: 3000; Tolerance: 20ppm; Termination: SMD/SMT; Series Resistance: 120R; Length: 0.126inch; Height: 0.039inch; Width: 0.098inch; Lead Free: Lead Free; ComponentLink1URL: https://datasheet.ciiva.com/862/abm8g-862338.pdf?src-supplier=Digi-Key; ComponentLink1Description: https://datasheet.ciiva.com/862/abm8g-862338.pdf?src-supplier=Digi-Key; ComponentLink2URL: https://datasheet.ciiva.com/16411/abm8g-16411115.pdf?src-supplier=Future+Electronics; ComponentLink2Description: https://datasheet.ciiva.com/16411/abm8g-16411115.pdf?src-supplier=Future+Electronics